# Altium project 28PinArduino.PrjPCB (part 3 of 3)
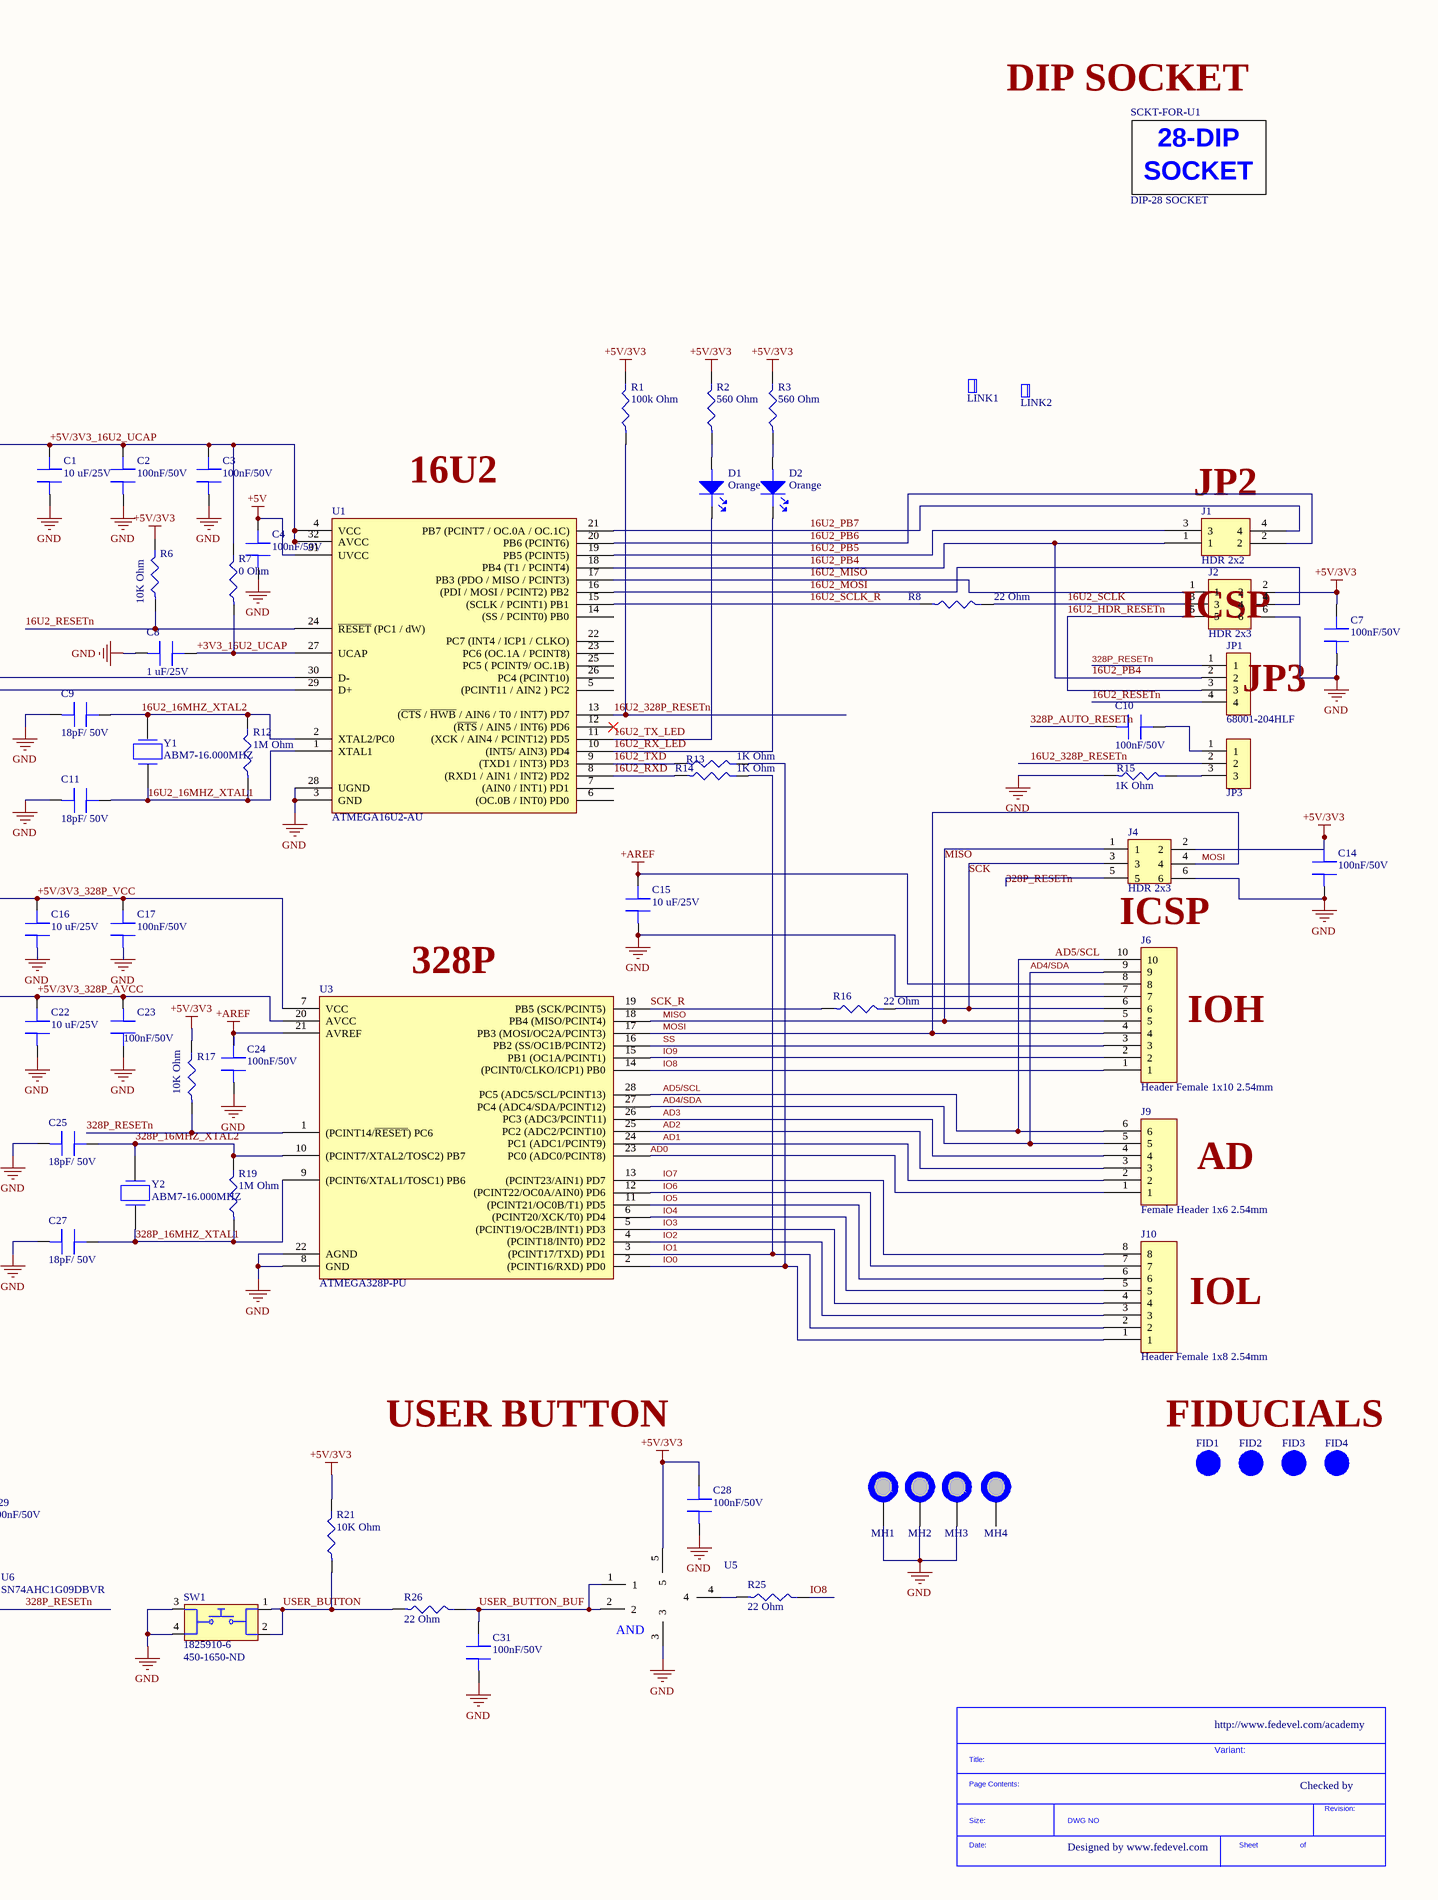
[diagram p6: [03] - 28PINS SCHEMATIC.SchDoc, right]

## Sheet [03] - 28PINS SCHEMATIC.SchDoc: 28 Pins (continued)

### Library data of the parts (continued)
SW1 SW2 = 1825910-6: SWITCH TACTILE SPST-NO 0.05A 24V; Manufacturer: TE Connectivity Alcoswitch; Mechanical Life: 100000Cycles; Actuator Material: PBT; Actuator Color: Black; Operating Force: 160gf; Illumination Type: Non-Illuminated,Illuminated; Throw Configuration: SPST; Switch Travel: 0.25mm; Switch Function: Off-Mom; Actuator Type: Standard; Contact Current Rating: 50mA; Contact Resistance: 100mR; Actuator Length: 0.055inch; Supplier 1: Digi-Key; Manufacturer Part Number: 1825910-6; Stock 1: 132465; Pricing 1: 1=0.1, 10=0.101, 25=0.0956, 100=0.087, 250=0.0818, 500=0.07484, 1000=0.06265, 5000=0.05743, 10000=0.05395 (USD); Mount: Through Hole; Contact Material: Copper Alloy; Contact Plating: Silver; Min Operating Temperature: -35°C; Max Operating Temperature: 85°C; Termination: PC Pins; Package Quantity: 750; Series: FSMJ; Packaging: Loose Piece; Orientation: Straight; Max Voltage Rating (DC): 24V; Electrical Life: 100000Cycles; Type: Switch; Max Current Rating: 50mA; Length: 5.99mm; REACH SVHC: Unknown; ELV: Compliant; Lead Free: Lead Free; ComponentLink1URL: http://www.onlinecomponents.com/productFiles/mf-AMP/1825910-6rqpn1825910-6.pdf?src-supplier=Onlinecomponents.com; ComponentLink1Description: http://www.onlinecomponents.com/productFiles/mf-AMP/1825910-6rqpn1825910-6.pdf?src-supplier=Onlinecomponents.com; ComponentLink2URL: http://www.te.com/commerce/DocumentDelivery/DDEController?Action=srchrtrv&DocNm=1825910&DocType=Customer+Drawing&DocLang=English&src-supplier=Verical; ComponentLink2Description: http://www.te.com/commerce/DocumentDelivery/DDEController?Action=srchrtrv&DocNm=1825910&DocType=Customer+Drawing&DocLang=English&src-supplier=Verical
U1 = ATMEGA16U2-AU: MICROCHIP - ATMEGA16U2-AU - MCU, 8BIT, MEGAAVR, 16MHZ, TQFP-32; Manufacturer: Microchip / Atmel; Core Architecture: AVR; Interface: SPI,UART,USB,USART,Serial; Number of I/Os: 22; Data Bus Width: 8b; Oscillator Type: Internal; Memory Type: FLASH; Memory Size: 16KB; Peripherals: Brown-out Detect/Reset,POR,PWM,WDT; RAM Size: 512B; Number of Timers/Counters: 2; Max Supply Voltage: 5.5V; Min Supply Voltage: 2.7V; Number of PWM Channels: 5; Number of SPI Channels: 1; Watchdog Timer: Yes; Supplier 1: Digi-Key; Manufacturer Part Number: ATMEGA16U2-AU; Stock 1: 1126; Pricing 1: 1=2.45, 25=2.25, 100=2.04 (USD); Mount: Surface Mount; Case/Package: A; Number of Pins: 32; Contact Plating: Tin,Matte; Min Operating Temperature: -40°C; Max Operating Temperature: 85°C; Package Quantity: 1250; Series: AVR® ATmega; Frequency: 16MHz; Packaging: Tray; Number of Programmable I/O: 22; Max Frequency: 16MHz; Length: 7mm; Width: 7mm; Height: 1.05mm; REACH SVHC: No SVHC; Lead Free: Lead Free; ComponentLink1URL: http://www.microchip.com/mymicrochip/filehandler.aspx?ddocname=en590463&src-supplier=Mouser; ComponentLink1Description: http://www.microchip.com/mymicrochip/filehandler.aspx?ddocname=en590463&src-supplier=Mouser; ComponentLink2URL: http://www.atmel.com/dyn/resources/prod_documents/doc7799.pdf?src-supplier=Farnell; ComponentLink2Description: http://www.atmel.com/dyn/resources/prod_documents/doc7799.pdf?src-supplier=Farnell; Supplier Part Number 1: ATMEGA16U2-AU-ND
U2 = TL1963A-33DCQR: IC REG LINEAR 3.3V 1.5A SOT223-6; Manufacturer: Texas Instruments; Dropout Voltage: 340mV; Number of Outputs: 1; Max Input Voltage: 20V; Min Input Voltage: 2.1V; Min Current Limit: 1.6A; Input Bias Current: 1mA; Polarity: Positive; Accuracy: 3%; Output Type: Fixed; Supplier 1: Digi-Key; Manufacturer Part Number: TL1963A-33DCQR; Stock 1: 1454; Pricing 1: 1=2.8, 10=2.513, 25=2.376, 100=1.9536, 250=1.75296, 500=1.6896, 1000=1.40448 (USD); Case/Package: SOT-223; Number of Pins: 6; Contact Plating: Gold; Min Operating Temperature: -40°C; Max Operating Temperature: 125°C; Package Quantity: 1; Packaging: Tape and Reel; Output Voltage: 3.3V; Output Current: 1.5A; Max Output Current: 1.5A; Number of Regulators: 1; Quiescent Current: 1mA; Max Output Voltage: 3.3V; Min Output Voltage: 3.3V; Series: -; Radiation Hardening: No; Lead Free: Lead Free; ComponentLink1URL: http://www.ti.com/lit/ds/symlink/tl1963a.pdf?src-supplier=Digi-Key; ComponentLink1Description: http://www.ti.com/lit/ds/symlink/tl1963a.pdf?src-supplier=Digi-Key; ComponentLink2URL: http://www.ti.com/lit/ds/symlink/tl1963a.pdf?src-supplier=Avnet+Europe; ComponentLink2Description: http://www.ti.com/lit/ds/symlink/tl1963a.pdf?src-supplier=Avnet+Europe; Supplier Part Number 1: 296-24534-1-ND
U3 = ATMEGA328P-PU: ATMEGA328P-PU; 8 bit Microcontroller AVR 20MHz 1; 32kb Flash; 2kb RAM; I2C SPI 2; Manufacturer: Microchip; Supplier 1: Digi-Key; Manufacturer Part Number: ATMEGA328P-PU; Stock 1: 10580; Pricing 1: 1=2.08, 25=1.91, 100=1.73 (USD); Number of Pins: 28; Supplier Part Number 1: ATMEGA328P-PU-ND
U4-U7 = SN74AHC1G09DBVR: TEXAS INSTRUMENTS - SN74AHC1G09DBVR - AND Gate, 74AHC1G09, 2 Input, 2 V to 5.5 V, SOT-23-5; Output Voltage: 5.5V; Number of Inputs: 2; Propagation Delay: 7.5ns; Min Supply Voltage: 2V; Output Current: 25mA; Number of Outputs: 1; Quiescent Current: 1uA; Low Level Output Current: 8mA; Supplier 1: Digi-Key; Manufacturer: Texas Instruments; Manufacturer Part Number: SN74AHC1G09DBVR; Stock 1: 14026; Pricing 1: 1=0.32, 10=0.24, 25=0.21, 100=0.1359, 250=0.11252, 500=0.09, 1000=0.069 (USD); Mount: Surface Mount; Case/Package: SOT-23; Number of Pins: 5; Contact Plating: Tin,Matte; Min Operating Temperature: -55°C; Max Operating Temperature: 125°C; Package Quantity: 3000; Packaging: Tape and Reel; Max Supply Voltage: 5.5V; Logic Function: AND GATE; Number of Circuits: 1; Number of Gates: 1; Number of Elements: 1; Number of Bits: 1; Series: 74AHC; Technology: CMOS; Radiation Hardening: No; REACH SVHC: No SVHC; Lead Free: Lead Free; ComponentLink1URL: http://www.ti.com/lit/ds/symlink/sn74ahc1g09.pdf?src-supplier=Digi-Key; ComponentLink1Description: http://www.ti.com/lit/ds/symlink/sn74ahc1g09.pdf?src-supplier=Digi-Key; Supplier Part Number 1: 296-29202-1-ND
Y1 Y2 = ABM7-16.000MHZ-D2Y-T: CRYSTAL 16.0000MHZ 18PF SMD; Manufacturer: Abracon; Frequency Tolerance: 20ppm; ESR (Equivalent Series Resistance): 50R; Frequency: 16MHz; Frequency Stability: 30ppm; Operating Frequency: 16 MHz; Supplier 1: Digi-Key; Manufacturer Part Number: ABM7-16.000MHZ-D2Y-T; Stock 1: 41068; Pricing 1: 1=0.87, 10=0.773, 50=0.7224, 100=0.6384, 500=0.6048 (USD); Mount: Surface Mount; Case/Package: CSMD; Number of Pins: 2; Min Operating Temperature: -40°C; Max Operating Temperature: 85°C; Load Capacitance: 18pF; Package Quantity: 1000; Tolerance: 20ppm; Packaging: Tape and Reel; Termination: SMD/SMT; Resistor Type: Ceramic; Series: ABM7; Length: 6mm; Width: 3.3mm; Height: 0.055inch; Depth: 3.5mm; Radiation Hardening: No; REACH SVHC: Unknown; Lead Free: Lead Free; ComponentLink1URL: https://www.verical.com/server-webapp/html/getDatasheet?partID=721624&src-supplier=Verical; ComponentLink1Description: https://www.verical.com/server-webapp/html/getDatasheet?partID=721624&src-supplier=Verical; ComponentLink2URL: http://www.farnell.com/datasheets/947971.pdf?src-supplier=Element14; ComponentLink2Description: http://www.farnell.com/datasheets/947971.pdf?src-supplier=Element14; ComponentLink3URL: http://www.abracon.com/Resonators/abm7.pdf?src-supplier=Farnell; ComponentLink3Description: http://www.abracon.com/Resonators/abm7.pdf?src-supplier=Farnell; ComponentLink4URL: http://www.abracon.com/Resonators/abm7.pdf?src-supplier=Future+Electronics; ComponentLink4Description: http://www.abracon.com/Resonators/abm7.pdf?src-supplier=Future+Electronics; ComponentLink5URL: https://abracon.com/Resonators/abm7.pdf?src-supplier=Digi-Key; ComponentLink5Description: https://abracon.com/Resonators/abm7.pdf?src-supplier=Digi-Key; ComponentLink6URL: http://www.abracon.com/Support/PackageDrawing/Resonators/ABM7.PDF?src-supplier=Verical; ComponentLink6Description: http://www.abracon.com/Support/PackageDrawing/Resonators/ABM7.PDF?src-supplier=Verical; Supplier Part Number 1: 535-9840-1-ND
Z1 Z2 = CG0603MLC-05E: VARISTOR 0603; Manufacturer: Bourns; Capacitance: 0.5pF; Voltage Rating (DC): 5V; Voltage Rating (AC): 8V; Number of Channels: 1; Clamping Voltage: 20V; Current Rating: 50nA; Turn-On Delay Time: 1ns; Element Configuration: Single; Supplier 1: Digi-Key; Manufacturer Part Number: CG0603MLC-05E; Stock 1: 103460; Pricing 1: 1=0.49, 10=0.348, 25=0.286, 100=0.2288, 250=0.1664, 500=0.1352, 1000=0.104, 2500=0.0936 (USD); Case/Package: 0603; Number of Pins: 2; Case Code (Imperial): 0603; Case Code (Metric): 1608; Contact Plating: Tin; Min Operating Temperature: -40°C; Max Operating Temperature: 85°C; Operating Supply Voltage: 5V; Package Quantity: 1; Packaging: Tape and Reel; Termination: SMD/SMT; Voltage: 5V; Number of Circuits: 1; Max Voltage Rating (DC): 5V; Working Voltage: 5V; Leakage Current: 50nA; Series: MLC; Length: 1.6mm; Width: 0.8mm; Depth: 0.8mm; Thickness: 0.8mm; Radiation Hardening: No; REACH SVHC: No SVHC; ComponentLink1URL: https://www.bourns.com/docs/Product-Datasheets/MLC.pdf?src-supplier=Digi-Key; ComponentLink1Description: https://www.bourns.com/docs/Product-Datasheets/MLC.pdf?src-supplier=Digi-Key; ComponentLink2URL: http://www.farnell.com/datasheets/2360367.pdf?src-supplier=Element14; ComponentLink2Description: http://www.farnell.com/datasheets/2360367.pdf?src-supplier=Element14; ComponentLink3URL: http://www.jameco.com/Jameco/Products/ProdDS/1163231.pdf?src-supplier=Jameco; ComponentLink3Description: http://www.jameco.com/Jameco/Products/ProdDS/1163231.pdf?src-supplier=Jameco; ComponentLink4URL: http://www.bourns.com/docs/Product-Datasheets/MLC.pdf?src-supplier=Avnet+Europe; ComponentLink4Description: http://www.bourns.com/docs/Product-Datasheets/MLC.pdf?src-supplier=Avnet+Europe; ComponentLink5URL: http://www.bourns.com/docs/Product-Datasheets/MLC.pdf?src-supplier=Avnet; ComponentLink5Description: http://www.bourns.com/docs/Product-Datasheets/MLC.pdf?src-supplier=Avnet; Supplier Part Number 1: CG0603MLC-05ECT-ND